# Altium schematic sheet plp-cd_2a.SchDoc
size 420 x 297 mm; Address1: Address1; Address2: Address2; Address3: Address3; Address4: Address4; DocumentNumber: АБВГ.123456.001 Э3; SheetNumber: 1; Scale: 1:1; DocumentType: Схема электрическая принципиальная; FirstReferrence: АБВГ.123456.001
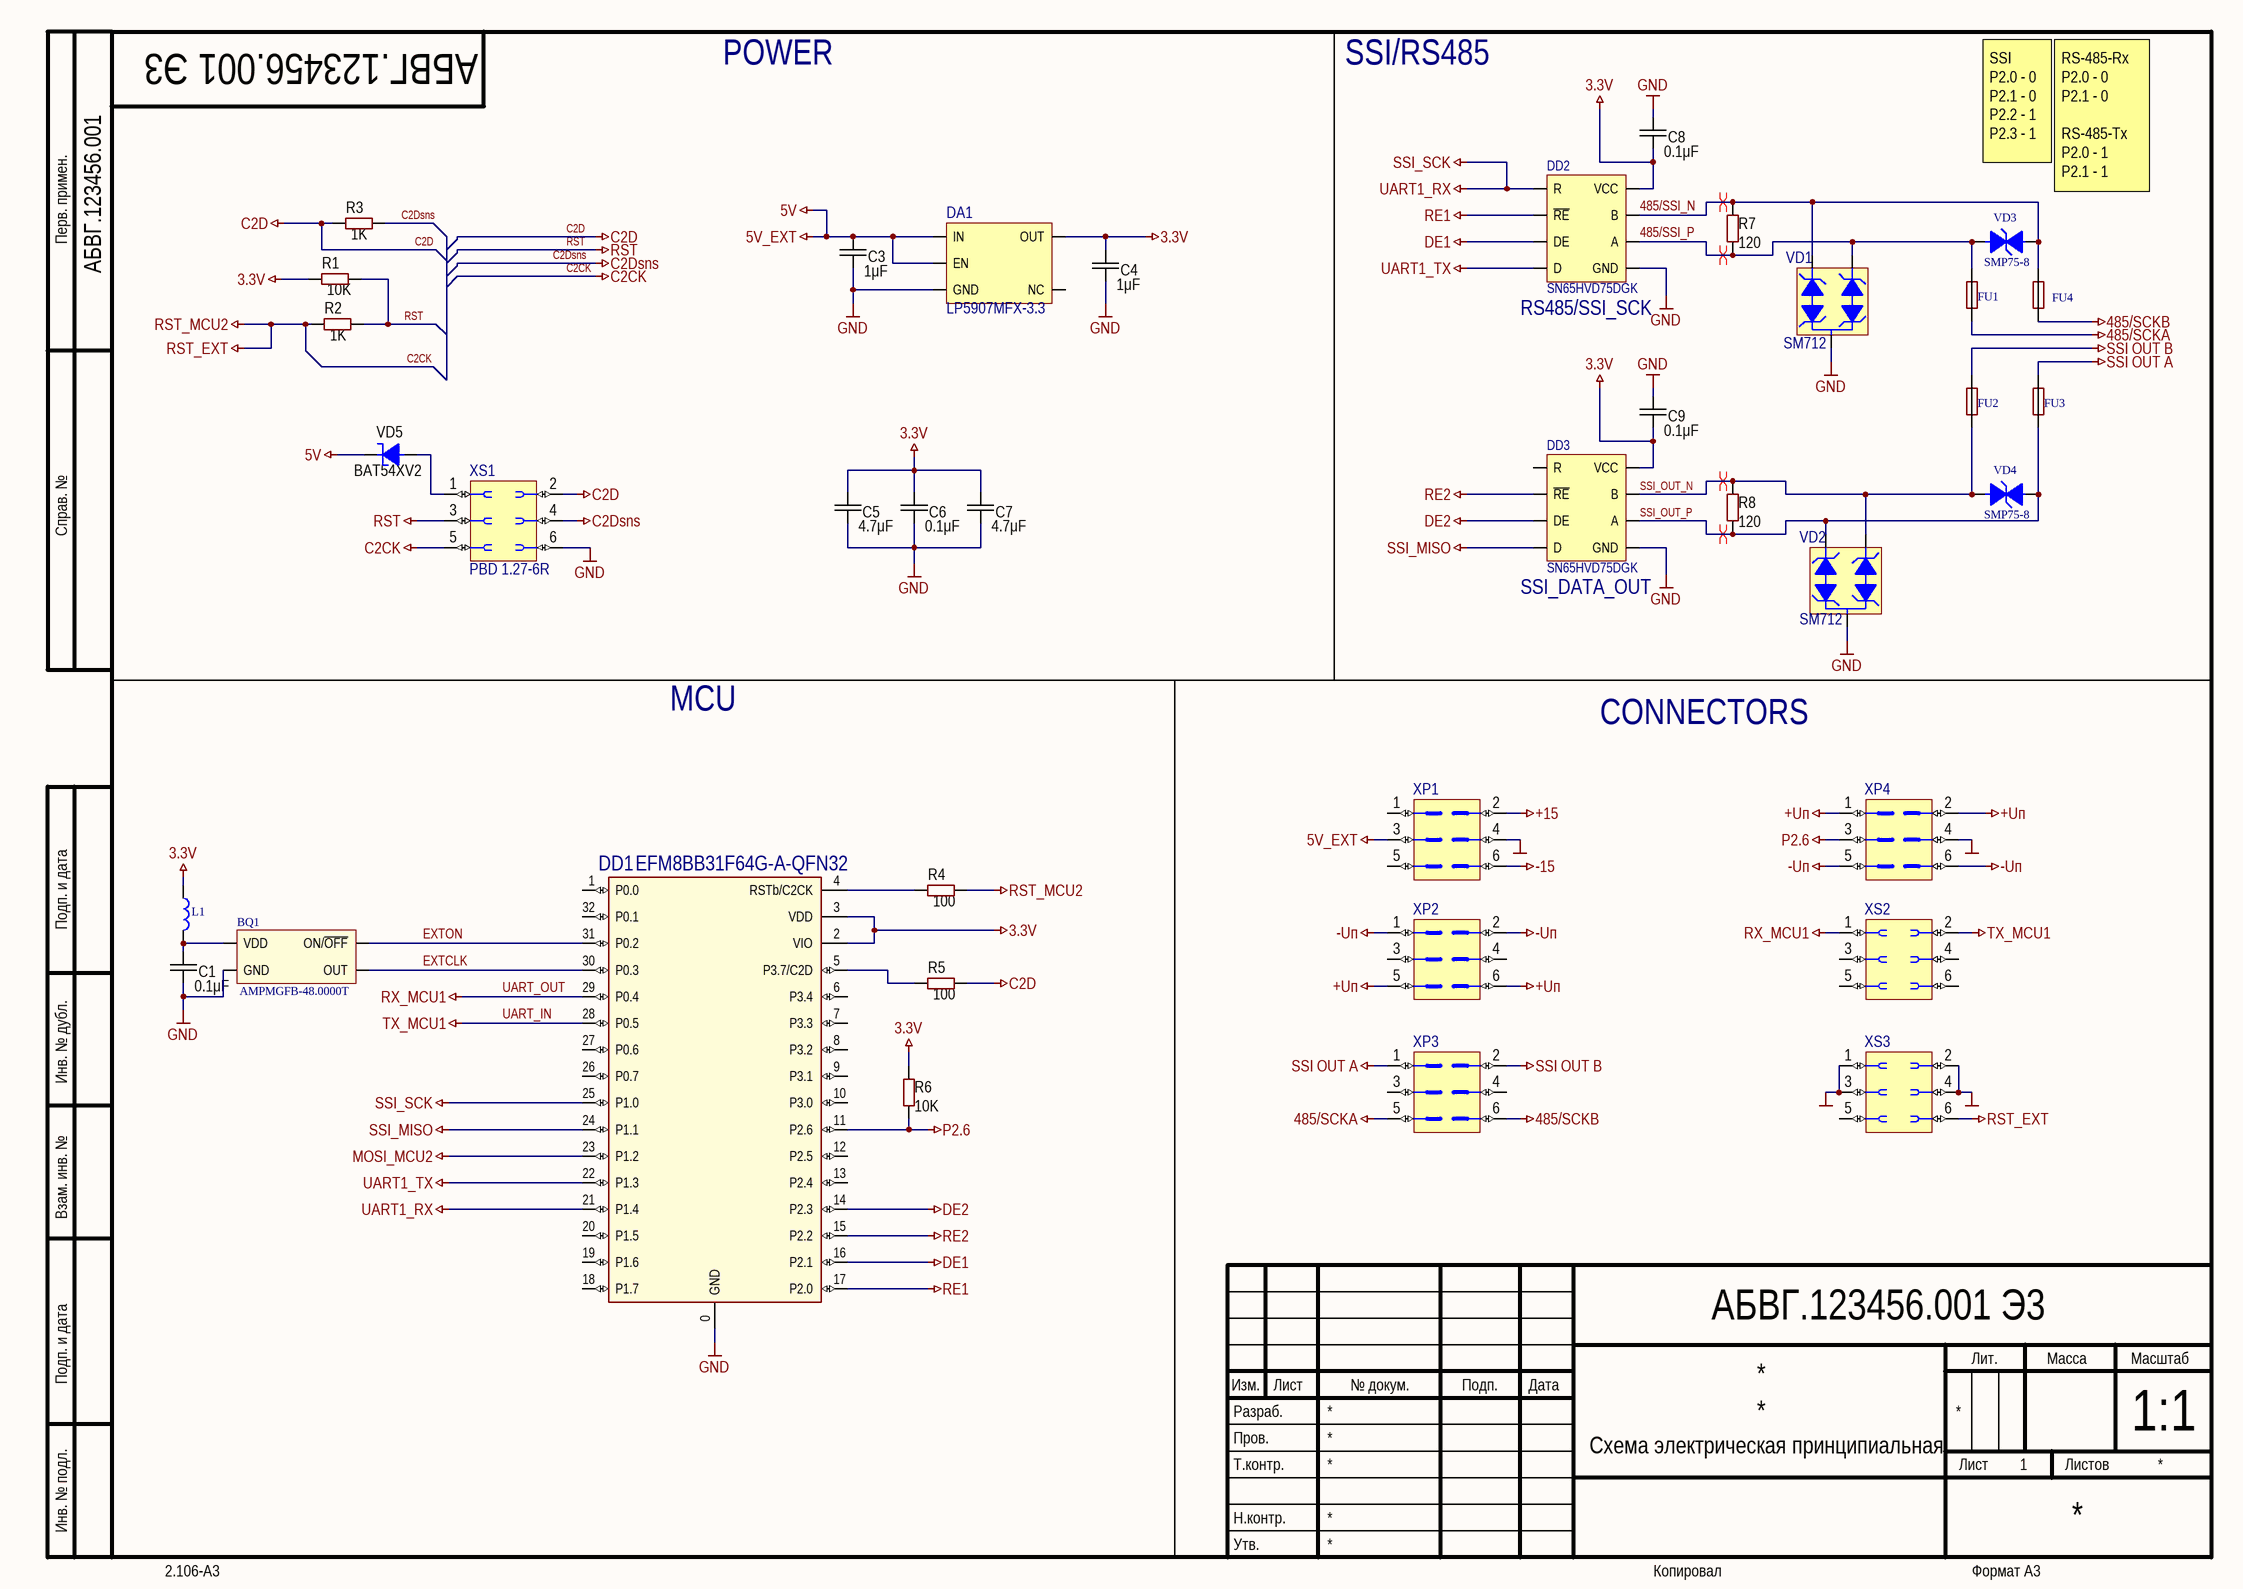
[diagram p0: plp-cd_2a.SchDoc]

## Parts
BQ1  AMPMGFB-48.0000T  [AMPMGFB(1.6x1.2)]
C1  value 0.1μF  [CAP: 0603]
C3  value 1μF  [CAP: 0603]
C4  value 1μF  [CAP: 0603]
C5  value 4.7μF  [CAP: 0603]
C6  value 0.1μF  [CAP: 0603]
C7  value 4.7μF  [CAP: 0603]
C8  value 0.1μF  [CAP: 0603]
C9  value 0.1μF  [CAP: 0603]
DA1  LP5907MFX-3.3  [SOT23-5]
DD1  EFM8BB31F64G-A-QFN32  [32-QFN(4x4)]
DD2  SN65HVD75DGK  [VSSOP-8]
DD3  SN65HVD75DGK  [VSSOP-8]
FU1  0zcm0002ff2g  [FUSE: 0603]  (value not drawn)
FU2  0zcm0002ff2g  [FUSE: 0603]  (value not drawn)
FU3  0zcm0002ff2g  [FUSE: 0603]  (value not drawn)
FU4  0zcm0002ff2g  [FUSE: 0603]  (value not drawn)
L1  BLM18AG102SN1D  [IND: 0603]  (value not drawn)
R1  value 10K  [RES: 0603]
R2  value 1K  [RES: 0603]
R3  value 1K  [RES: 0603]
R4  value 100  [RES: 0603]
R5  value 100  [RES: 0603]
R6  value 10K  [RES: 0603]
R7  value 120  [RES: 0603]
R8  value 120  [RES: 0603]
VD1  SM712  [SOT23]
VD2  SM712  [SOT23]
VD3  SMP75-8  [DIODE: SMB]
VD4  SMP75-8  [DIODE: SMB]
VD5  PartNumber: BAT54XV2  [DIODE: SOD523]
XP1  2199R05-06G-301523  [CON: PLL-6(2x3R1.27male)]  (value not drawn)
XP2  2199R05-06G-301523  [CON: PLL-6(2x3R1.27male)]  (value not drawn)
XP3  2199R05-06G-301523  [CON: PLL-6(2x3R1.27male)]  (value not drawn)
XP4  2199R05-06G-301523  [CON: PLL-6(2x3R1.27male)]  (value not drawn)
XS1  PBD 1.27-6R  [CON: PLLD-6R(1.27)]
XS2  2199R05-06G-301523  [CON: PLL-6(2x3R1.27female)]  (value not drawn)
XS3  2199R05-06G-301523  [CON: PLL-6(2x3R1.27female)]  (value not drawn)

## Nets
3.3V: C4.2 C5.2 C6.2 C7.2 C8.1 C9.1 DA1.5(OUT) DD1.2(VIO) DD1.3(VDD) DD2.8(VCC) DD3.8(VCC) L1.1 R1.1 R6.2
5V: C3.2 DA1.1(IN) DA1.3(EN) VD5.2 XP1.3  [also labelled 5V_EXT]
485/SCKA: FU1.1 XP3.5
485/SCKB: FU4.1 XP3.6
+15: XP1.2
+Uп: XP2.5 XP2.6 XP4.1 XP4.2
-15: XP1.6
-Uп: XP2.1 XP2.2 XP4.5 XP4.6
C2CK: R2.1 R4.2 XS1.5 XS3.6  [also labelled RST_EXT, RST_MCU2]
C2D: R3.1 R5.2 XS1.2
C2Dsns: R3.2 XS1.4
DE1: DD1.16(P2.1) DD2.3(DE)
DE2: DD1.14(P2.3) DD3.3(DE)
GND: BQ1.2(GND) C1.1 C3.1 C4.1 C5.1 C6.1 C7.1 C8.2 C9.2 DA1.2(GND) DD1.0(GND) DD2.5(GND) DD3.5(GND) VD1.3 VD2.3 XP1.4 XP4.4 XS1.6 XS3.1 XS3.2 XS3.3 XS3.4
MOSI_MCU2: DD1.23(P1.2)
P2.6: DD1.11(P2.6) R6.1 XP4.3
RE1: DD1.17(P2.0) DD2.2(~{RE})
RE2: DD1.15(P2.2) DD3.2(~{RE})
RST: R1.2 R2.2 XS1.3
SSI OUT A: FU3.2 XP3.1
SSI OUT B: FU2.2 XP3.2
SSI_MISO: DD1.24(P1.1) DD3.4(D)
SSI_SCK: DD1.21(P1.4) DD1.25(P1.0) DD2.1(R)  [also labelled UART1_RX]
UART1_TX: DD1.22(P1.3) DD2.4(D)
UART_IN: DD1.28(P0.5) XS2.2  [also labelled TX_MCU1]
UART_OUT: DD1.29(P0.4) XS2.1  [also labelled RX_MCU1]
485/SSI_N: DD2.7(B) FU4.2 R7.2 VD1.1 VD3.2
485/SSI_P: DD2.6(A) FU1.2 R7.1 VD1.2 VD3.1
EXTCLK: BQ1.3(OUT) DD1.30(P0.3)
EXTON: BQ1.1(ON/~{OFF}) DD1.31(P0.2)
SSI_OUT_N: DD3.7(B) FU2.1 R8.2 VD2.1 VD4.1
SSI_OUT_P: DD3.6(A) FU3.1 R8.1 VD2.2 VD4.2
NetBQ1_4: BQ1.4(VDD) C1.2 L1.2
NetDD1_4: DD1.4(RSTb/C2CK) R4.1
NetDD1_5: DD1.5(P3.7/C2D) R5.1
NetVD5_1: VD5.1 XS1.1

Not connected (* = marked no-connect by the designer): DA1 4(NC); DD1 1(P0.0) 6(P3.4) 7(P3.3) 8(P3.2) 9(P3.1) 10(P3.0) 12(P2.5) 13(P2.4) 18(P1.7) 19(P1.6) 20(P1.5) 26(P0.7) 27(P0.6) 32(P0.1); DD3 1(R); XP1 1 5; XP2 3 4; XP3 3 4; XS2 3 4 5 6; XS3 5

## Layout directives
differential pair: 485/SSI_N, 485/SSI_P, SSI_OUT_N, SSI_OUT_P

## Notes on the sheet
- POWER
- SSI/RS485
- SSI
  P2.0 - 0
  P2.1 - 0
  P2.2 - 1
  P2.3 - 1
- RS-485-Rx
  P2.0 - 0
  P2.1 - 0
  RS-485-Tx
  P2.0 - 1
  P2.1 - 1
- (near DD2) RS485/SSI_SCK
- (near DD3) SSI_DATA_OUT
- MCU
- CONNECTORS
- Перв. примен.
- Справ. №
- Подп. и дата
- Инв. № дубл.
- Взам. инв. №
- Разраб.
- Изм.
- Лист
- № докум.
- Подп.
- Дата
- Лит.
- Масса
- Масштаб
- Пров.
- Т.контр.
- Листов
- Инв. № подл.
- Утв.
- Н.контр.
- 2.106-A3
- Копировал
- Формат А3

## Library data of the parts
C1 C6 C8 C9 = Ceramic_0603: Manufacturer: Yageo; PartNumber: CC0603KRX7R7BB104; ValueManufacturerPartNumber: Ceramic capacitor, 0.1μF, X7R, ±10%, 16V, 0603, -55...+125°C; TypeCapacitor: Ceramic capacitor; Tolerance: ±10%; TypeDielectric: X7R; Voltage: 16V; Package: 0603; HelpURL: https://www.digikey.com/product-detail/en/yageo/CC0603KRX7R7BB104/311-1088-1-ND/302998; Temperature: -55...+125°C
C3 C4 = Ceramic_0603: Manufacturer: Yageo; PartNumber: CC0603KRX7R7BB104; ValueManufacturerPartNumber: Ceramic capacitor, 1μF, X7R, ±10%, 16V, 0603, -55...+125°C; TypeCapacitor: Ceramic capacitor; Tolerance: ±10%; TypeDielectric: X7R; Voltage: 16V; Package: 0603; HelpURL: https://www.digikey.com/product-detail/en/yageo/CC0603KRX7R7BB104/311-1088-1-ND/302998; Temperature: -55...+125°C
C5 C7 = Ceramic_0603: Manufacturer: Yageo; PartNumber: CC0603KRX7R7BB104; ValueManufacturerPartNumber: Ceramic capacitor, 4.7μF, X7R, ±10%, 16V, 0603, -55...+125°C; TypeCapacitor: Ceramic capacitor; Tolerance: ±10%; TypeDielectric: X7R; Voltage: 16V; Package: 0603; HelpURL: https://www.digikey.com/product-detail/en/yageo/CC0603KRX7R7BB104/311-1088-1-ND/302998; Temperature: -55...+125°C
DA1 = LP5907MFX-3.3: LDO 250 mA
DD1 = EFM8BB31F64G-A-QFN32: 8051 MCU Core
DD2 DD3 = SN65HVD72DGK: RS-485/422; ComponentLink1Description: Datasheet; ComponentLink1URL: https://www.ti.com/lit/ds/symlink/sn65hvd72.pdf?ts=1607084930164&ref_url=https%253A%252F%252Fwww.ti.com%252Fstore%252Fti%252Fen%252Fp%252Fproduct%252F%253Fp%253DSN65HVD72DRBT
FU1-FU4 = FUSE:0603
L1 = BLM18AG102SN1D: 100MHz 1K
R1 R6 = Resistor_0603: Manufacturer: Yageo; PartNumber: RC0603JR-07100RL; ValueManufacturerPartNumber: Resistor film, 10K, ±5%, 0603, 0.1W, -55...+125°C; TypeResistor: Resistor film; Power: 0.1W; Tolerance: ±5%; Package: 0603; HelpURL: https://www.digikey.com/product-detail/en/yageo/RC0603JR-07100RL/311-100GRCT-ND/729644; Temperature: -55...+125°C
R2 R3 = Resistor_0603: Manufacturer: Yageo; PartNumber: RC0603JR-07100RL; ValueManufacturerPartNumber: Resistor film, 1K, ±5%, 0603, 0.1W, -55...+125°C; TypeResistor: Resistor film; Power: 0.1W; Tolerance: ±5%; Package: 0603; HelpURL: https://www.digikey.com/product-detail/en/yageo/RC0603JR-07100RL/311-100GRCT-ND/729644; Temperature: -55...+125°C
R4 R5 = Resistor_0603: Manufacturer: Yageo; PartNumber: RC0603JR-07100RL; ValueManufacturerPartNumber: Resistor film, 100, ±5%, 0603, 0.1W, -55...+125°C; TypeResistor: Resistor film; Power: 0.1W; Tolerance: ±5%; Package: 0603; HelpURL: https://www.digikey.com/product-detail/en/yageo/RC0603JR-07100RL/311-100GRCT-ND/729644; Temperature: -55...+125°C
R7 R8 = Resistor_0603: Manufacturer: Yageo; PartNumber: RC0603JR-07100RL; ValueManufacturerPartNumber: Resistor film, 120, ±5%, 0603, 0.1W, -55...+125°C; TypeResistor: Resistor film; Power: 0.1W; Tolerance: ±5%; Package: 0603; HelpURL: https://www.digikey.com/product-detail/en/yageo/RC0603JR-07100RL/311-100GRCT-ND/729644; Temperature: -55...+125°C
VD1 = SM712: EIA RS-485 ±7V ±12V
VD2 = SM712: EIA RS-485 ±7V
VD3 VD4 = SMBJ10CA-TR
VD5 = Schottky_single: Manufacturer: Diodes Incorporated; ValueManufacturerPartNumber: Schottky diode, 80V, 500mA, 1V, 15pF, SOD-123, -55...+150°C; TypeDiode: Schottky diode; Voltage: 80V; Current: 500mA; VoltageDrop: 1V; RecoveryTime: 15pF; Package: SOD-123; HelpURL: https://www.digikey.com/product-detail/en/diodes-incorporated/MBR0580S1-7/MBR0580S1-7DICT-ND/5080371; Temperature: -55...+150°C
XP1-XP4 = 2199R05-06G-301523Out: Step 1.27 R
XS2 XS3 = 2199R05-06G-301523In: Step 1.27